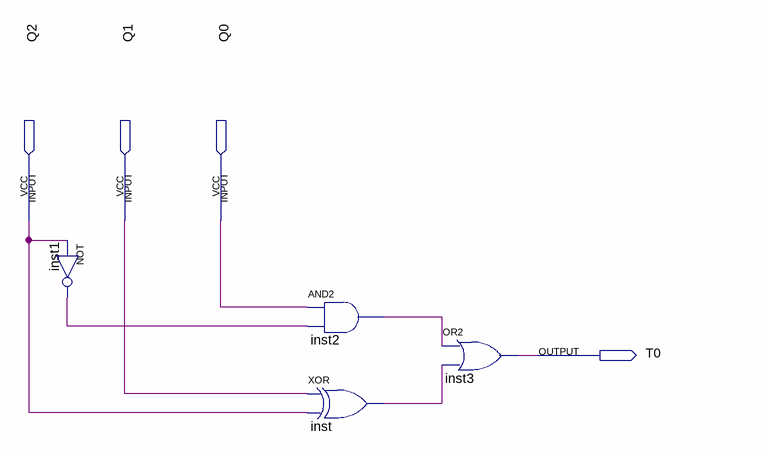
[diagram p0: schematic sheet]
// Quartus schematic T0.bdf as structural Verilog: 4 symbols, 4 pins
module T0 (
  input  Q2,
  input  Q1,
  input  Q0,
  output T0
);

  wire inst1_out, inst2_out, inst_out;

  not inst1 (inst1_out, Q2);
  and inst2 (inst2_out, Q0, inst1_out);
  xor inst (inst_out, Q1, Q2);
  or inst3 (T0, inst2_out, inst_out);
endmodule
